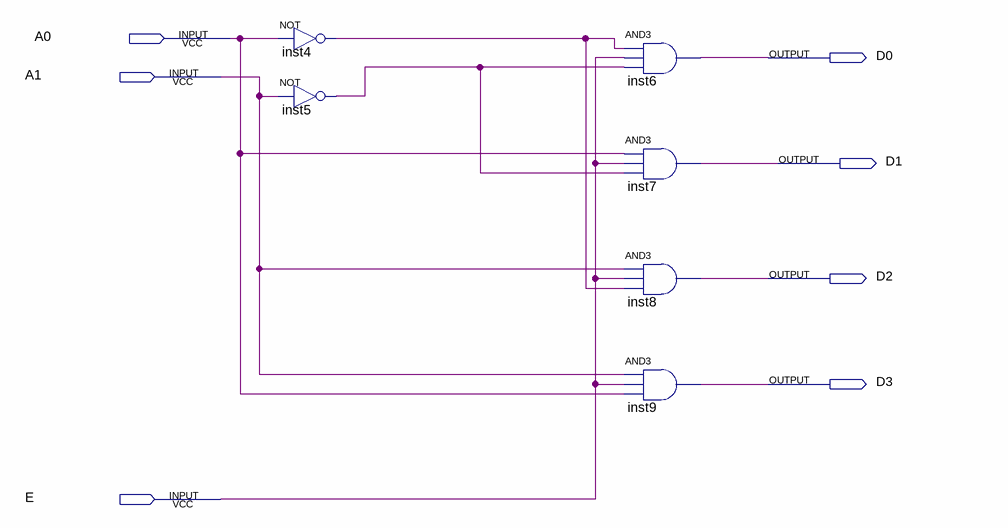
[diagram p0: schematic sheet]
// Quartus schematic 2to4decoder.bdf as structural Verilog: 6 symbols, 7 pins
module \2to4decoder  (
  input  A0,
  input  A1,
  input  E,
  output D0,
  output D1,
  output D2,
  output D3
);

  wire inst4_out, inst5_out;

  not inst4 (inst4_out, A0);
  not inst5 (inst5_out, A1);
  and inst6 (D0, inst4_out, E, inst5_out);
  and inst7 (D1, A0, E, inst5_out);
  and inst8 (D2, A1, E, inst4_out);
  and inst9 (D3, A1, E, A0);
endmodule
